# EAGLE design network_tester (EAGLE 9.0.1)

## Sheet 1 of 2
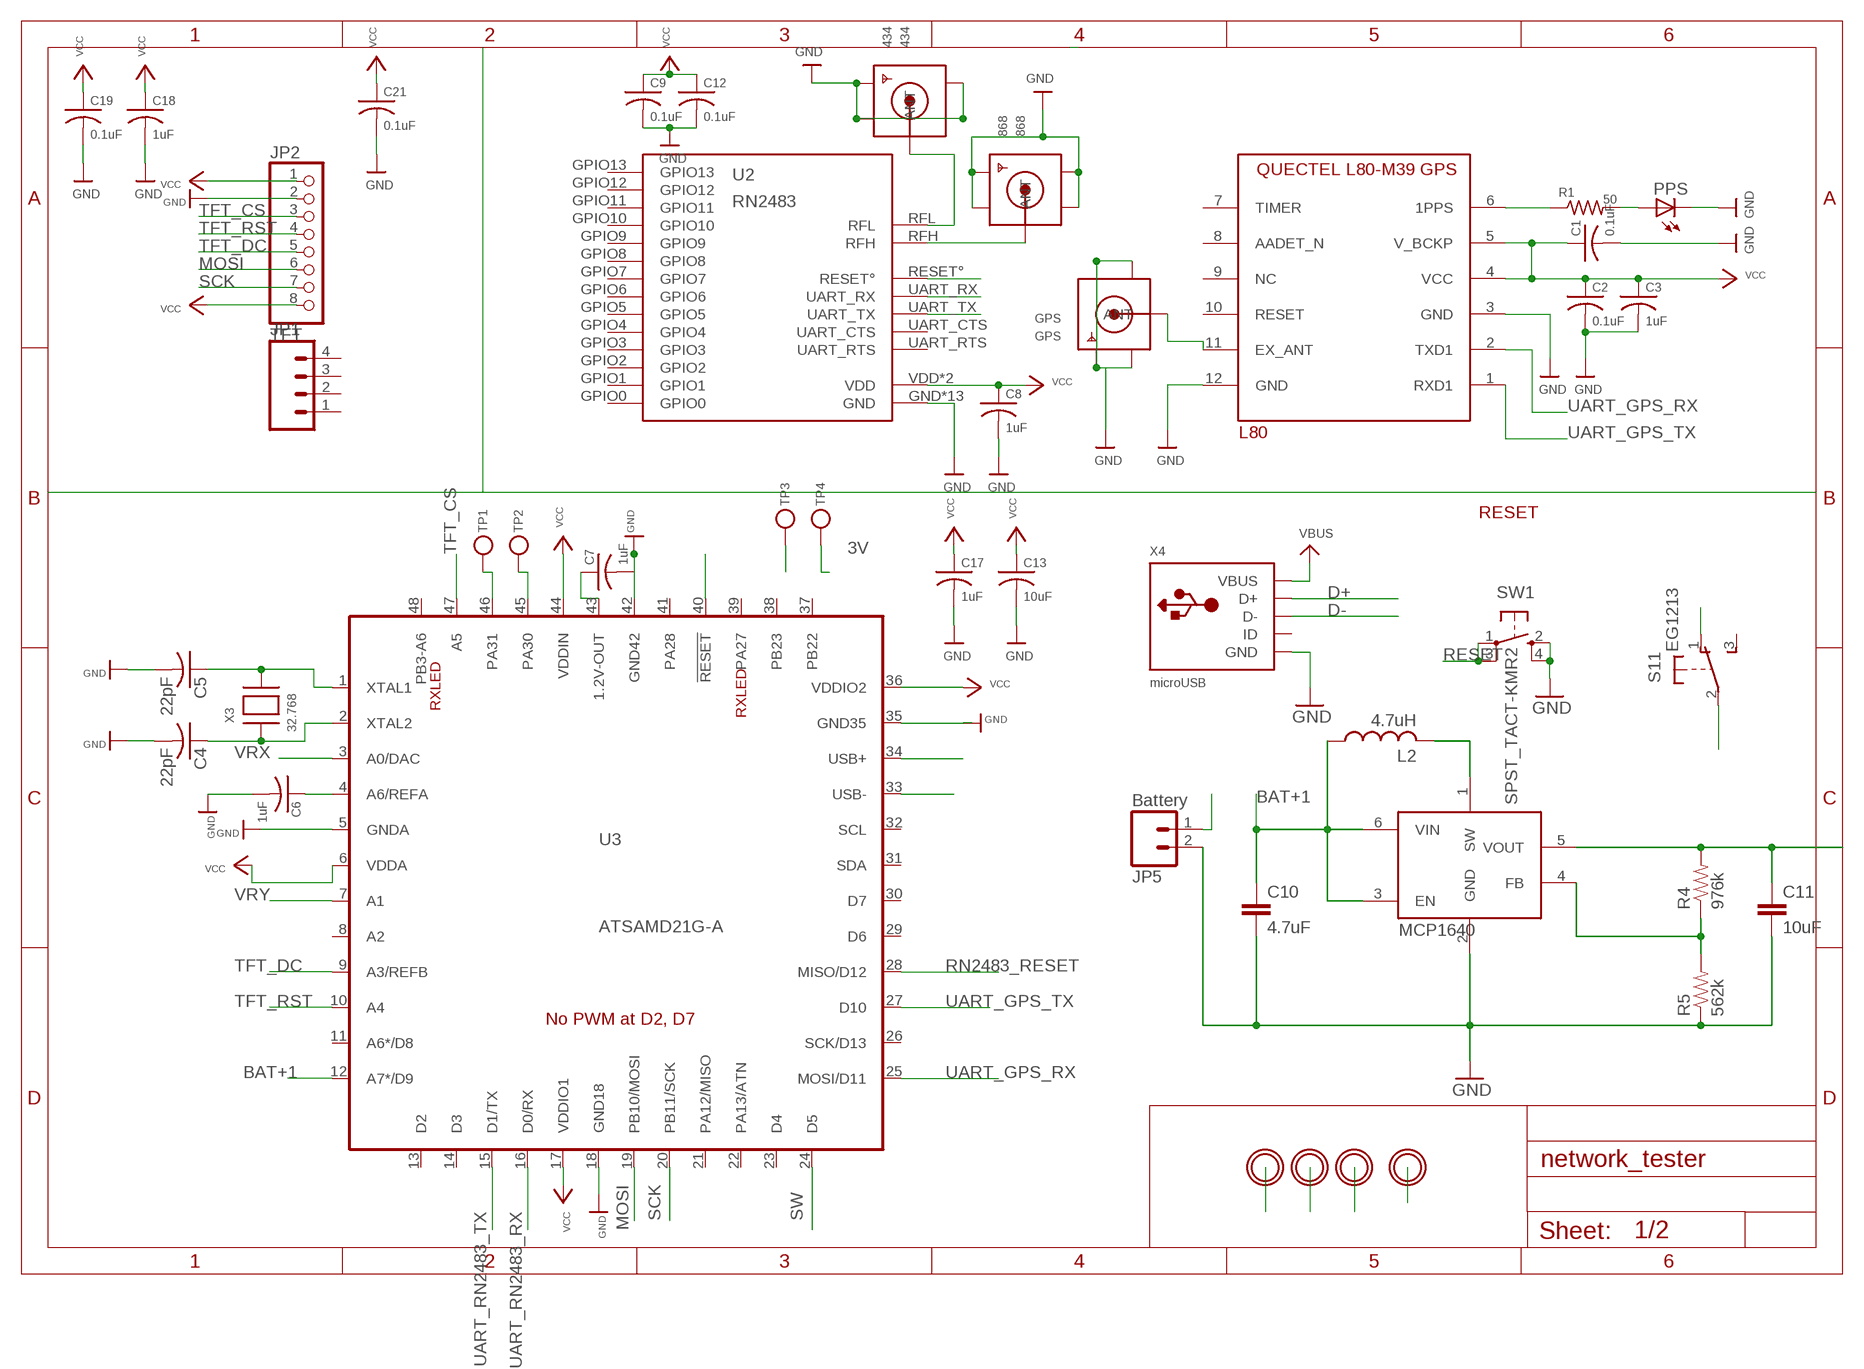
[diagram p0: schematic, sheet 1]

### Parts
434  434  SMACONNECTOR_EDGE_UFL  [SMA_EDGELAUNCH_UFL]
868  868  SMACONNECTOR_EDGE_UFL  [SMA_EDGELAUNCH_UFL]
C1  0.1uF  C-USC0603  [C0603]
C2  0.1uF  C-USC0603  [C0603]
C3  1uF  C-USC0805  [C0805]
C4  22pF  C-USC0603  [C0603]
C5  22pF  C-USC0603  [C0603]
C6  1uF  C-USC0603  [C0603]
C7  1uF  C-USC0603  [C0603]
C8  1uF  C-USC0805  [C0805]
C9  0.1uF  C-USC0603  [C0603]
C10  4.7uF  CAP0805  [0805]
C11  10uF  CAP0805  [0805]
C12  0.1uF  C-USC0603  [C0603]
C13  10uF  C-USC0805  [C0805]
C17  1uF  C-USC0603  [C0603]
C18  1uF  C-USC0805  [C0805]
C19  0.1uF  C-USC0603  [C0603]
C21  0.1uF  C-USC0603  [C0603]
GPS  GPS  SMACONNECTOR_EDGE_UFL  [SMA_EDGELAUNCH_UFL]
H1  MOUNTINGHOLE2.5  [MOUNTINGHOLE_2.5_PLATED]
H2  MOUNTINGHOLE2.5  [MOUNTINGHOLE_2.5_PLATED]
H3  MOUNTINGHOLE2.5  [MOUNTINGHOLE_2.5_PLATED]
H4  MOUNTINGHOLE2.5  [MOUNTINGHOLE_2.5_PLATED]
JP1  M04PTH  [1X04]
JP2  TFT  PINHD-1X8BIG  [1X08-BIG]
JP5  Battery  M02PTH  [1X02]
L2  4.7uH  LLQH44P_P0  [LQH44]
L80  L80  L80_GNSS_MODULE  [L80_PACKAGE]
PPS  LEDCHIPLED_0805  [CHIPLED_0805]
R1  50  R-US_R0805  [R0805]
R4  976k  RESISTOR0805-RES  [0805]
R5  562k  RESISTOR0805-RES  [0805]
S1  EG1213  [EG1213]
SW1  SPST_TACT-KMR2  [KMR2]
TP1  TESTPOINTROUND1.5MM  [TESTPOINT_ROUND_1.5MM]
TP2  TESTPOINTROUND1.5MM  [TESTPOINT_ROUND_1.5MM]
TP3  TESTPOINTROUND1.5MM  [TESTPOINT_ROUND_1.5MM]
TP4  TESTPOINTROUND1.5MM  [TESTPOINT_ROUND_1.5MM]
U2  RN2483  [RN2483]
U3  ATSAMD21G-A  [TQFP-48]
U5  MCP1640  [SOT23-6]
X3  32.768  XTAL-3.2X1.5  [XTAL3215]
X4  microUSB  USB_MICRO_20329_V2  [4UCONN_20329_V2]

### Nets
3V: C1.1 C2.1 C3.1 C8.1 C9.1 C11.1 C12.1 C13.1 C17.1 C18.1 C19.1 C21.1 JP2.1 JP2.8 L80.4(VCC) L80.5(V_BCKP) R4.2 TP4.P$1 U2.VDD U2.VDD2(VDD) U3.6(VDDA) U3.17(VDDIO1) U3.36(VDDIO2) U3.44(VDDIN) U5.5(VOUT) ; supply symbol labelled VCC ; also sheet 2
BAT+1: C10.1 L2.P$1 S1.2(1:P) U3.12(A7*/D9) U5.3(EN) U5.6(VIN)
D+: U3.34(USB+) X4.D+
D-: U3.33(USB-) X4.D-
GND: 434.GND@1(GND1) 434.GND@2(GND2) 434.GND@3(GND3) 434.GND@4(GND4) 868.GND@1(GND1) 868.GND@2(GND2) 868.GND@3(GND3) 868.GND@4(GND4) C1.2 C2.2 C3.2 C4.2 C5.2 C6.2 C8.2 C9.2 C10.2 C11.2 C12.2 C13.2 C17.2 C18.2 C19.2 C21.2 GPS.GND@1(GND1) GPS.GND@2(GND2) GPS.GND@3(GND3) GPS.GND@4(GND4) JP2.2 JP5.2 L80.3(GND) L80.12(GND) PPS.C R5.1 SW1.2(S) SW1.4(S1) TP3.P$1 U2.GND U2.GND1(GND) U2.GND2(GND) U2.GND3(GND) U2.GND4(GND) U2.GND5(GND) U2.GND6(GND) U2.GND7(GND) U2.GND8(GND) U2.GND9(GND) U2.GND10(GND) U2.GND11(GND) U2.GND12(GND) U3.5(GNDA) U3.18(GND18) U3.35(GND35) U3.42(GND42) U5.2(GND) X4.BASE@1(GND) X4.BASE@2(GND) X4.GND X4.SPRT@1(GND) X4.SPRT@2(GND) X4.SPRT@3(GND) X4.SPRT@4(GND) ; also sheet 2
MOSI: JP2.6 U3.19(PB10/MOSI)
N$1: L80.6(1PPS) R1.1
N$2: PPS.A R1.2
N$3: C4.1 U3.2(XTAL2) X3.P$1
N$5: 868.P(ANT) U2.RFH
N$7: C5.1 U3.1(XTAL1) X3.P$2
N$8: C6.1 U3.4(A6/REFA)
N$9: C7.1 U3.43(1.2V-OUT)
N$10: TP1.P$1 U3.46(PA31)
N$11: TP2.P$1 U3.45(PA30)
N$12: 434.P(ANT) U2.RFL
N$15: L2.P$2 U5.1(SW)
N$16: R4.1 R5.2 U5.4(FB)
N$18: GPS.P(ANT) L80.11(EX_ANT)
PWRIN: JP5.1 S1.1(1:O)
RESET: SW1.1(P) SW1.3(P1) U3.40(!RESET!)
RN2483_RESET: U2.RESET° U3.28(MISO/D12)
SCK: JP2.7 U3.20(PB11/SCK)
SW: U3.24(D5) ; also sheet 2
TFT_CS: JP2.3 U3.47(A5)
TFT_DC: JP2.5 U3.9(A3/REFB)
TFT_RST: JP2.4 U3.10(A4)
UART_GPS_RX: L80.2(TXD1) U3.25(MOSI/D11)
UART_GPS_TX: L80.1(RXD1) U3.27(D10)
UART_RN2483_RX: U2.UART_TX U3.16(D0/RX)
UART_RN2483_TX: U2.UART_RX U3.15(D1/TX)
VBUS: X4.VBUS
VRX: U3.3(A0/DAC) ; also sheet 2
VRY: U3.7(A1) ; also sheet 2
Unconnected: C7.2 JP1.1 JP1.2 JP1.3 JP1.4 L80.7(TIMER) L80.8(AADET_N) L80.9(NC) L80.10(RESET) S1.3(1:S) S1.MT1(MT) S1.MT2(MT) U2.GPIO0 U2.GPIO1 U2.GPIO2 U2.GPIO3 U2.GPIO4 U2.GPIO5 U2.GPIO6 U2.GPIO7 U2.GPIO8 U2.GPIO9 U2.GPIO10 U2.GPIO11 U2.GPIO12 U2.GPIO13 U2.UART_CTS U2.UART_RTS U3.8(A2) U3.11(A6*/D8) U3.13(D2) U3.14(D3) U3.21(PA12/MISO) U3.22(PA13/ATN) U3.23(D4) U3.26(SCK/D13) U3.29(D6) U3.30(D7) U3.31(SDA) U3.32(SCL) U3.37(PB22) U3.38(PB23) U3.39(PA27) U3.41(PA28) U3.48(PB3-A6) X4.ID

### Notes on the sheet
- RESET

## Sheet 2 of 2
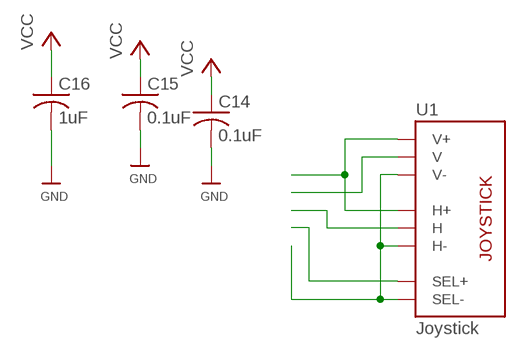
[diagram p1: schematic, sheet 2]

### Parts
C14  0.1uF  C-USC0603  [C0603]
C15  0.1uF  C-USC0603  [C0603]
C16  1uF  C-USC0805  [C0805]
U1  Joystick  JOYSTICKPTH  [JOYSTICK]

### Nets
3V: C14.1 C15.1 C16.1 U1.H1(H+) U1.V1(V+) ; supply symbol labelled VCC ; also sheet 1
GND: C14.2 C15.2 C16.2 U1.B2A(SEL-) U1.H3(H-) U1.V3(V-) ; also sheet 1
SW: U1.B1A(SEL+) ; also sheet 1
VRX: U1.H2(H) ; also sheet 1
VRY: U1.V2(V) ; also sheet 1

## Library data of the parts
434 868 GPS = adafruit:SMACONNECTOR: SMA Connector 90° DIP SMA Connector, 50 Ohm (4UConnector: 07259)
C1-C9 C12-C19 C21 = adafruit:C-US: CAPACITOR, American symbol
C10 C11 = SparkFun:CAP: Capacitor Standard 0603 ceramic capacitor, and 0.1" leaded capacitor.
H1-H4 = Adafruit Feather M0 Basic rev C:MOUNTINGHOLE: Mounting Hole For #2 screws (0.086"/2.18mm width, 0.094"/2.4mm hole) use 2.5mm; BOM: EXCLUDE
JP1 = SparkFun-Connectors:M04: Header 4 Standard 4-pin 0.1" header. Use with straight break away headers (SKU : PRT-00116), right angle break away headers (PRT-00553), swiss pins (PRT-00743), machine pins (PRT-00117), and female headers (PRT-00115). Molex polarized connector foot print use with SKU : PRT-08231 with associated crimp pins and housings. 1MM SMD Version SKU: PRT-10208
JP2 = adafruit:PINHD-1X8: PIN HEADER
JP5 = SparkFun:M02: Header 2 Standard 2-pin 0.1" header. Use with straight break away headers (SKU : PRT-00116), right angle break away headers (PRT-00553), swiss pins (PRT-00743), machine pins (PRT-00117), and female headers (PRT-00115). Molex polarized connector foot print use with SKU : PRT-08233 with associated crimp pins and housings.
L2 = karlnet-parts:L
L80 = Quectel:L80_GNSS_MODULE: GPS module with an embedded patch antenna (15mmx15mmx4mm)
PPS = adafruit:LED: LED OSRAM: - CHIPLED LG R971, LG N971, LY N971, LG Q971, LY Q971, LO R971, LY R971 LH N974, LH R974 LS Q976, LO Q976, LY Q976 LO Q996 - Hyper CHIPLED LW Q18S LB Q993, LB Q99A, LB R99A - SideLED LS A670, LO A670, LY A670, LG A670, LP A670 LB A673, LV A673, LT A673, LW A673 LH A674 LY A675 LS A676, LA A676, LO A676, LY A676, LW A676 LS A679, LY A679, LG A679 - Hyper Micro SIDELED® LS Y876, LA Y876, LO Y876, LY Y876 LT Y87S - SmartLED LW L88C, LW L88S LB L89C, LB L89S, LG L890 LS L89K, LO L89K, LY L89K LS L896, LA L896, LO L896, LY L896 - TOPLED LS T670, LO T670, LY T670, LG T670, LP T670 LSG T670, LSP T670, LSY T670, LOP T670, LYG T670 LG T671, LOG T671, LSG T671 LB T673, LV T673, LT T673, LW T673 LH T674 LS T676, LA T676, LO T676, LY T676, LB T676, LH T676, LSB T676, LW T676 LB T67C, LV T67C, LT T67C, LS T67K, LO T67K, LY T67K, LW E67C LS E67B, LA E67B, LO E67B, LY E67B, LB E67C, LV E67C, LT E67C LW T67C LS T679, LY T679, LG T679 LS T770, LO T770, LY T770, LG T770, LP T770 LB T773, LV T773, LT T773, LW T773 LH T774 LS E675, LA E675, LY E675, LS T675 LS T776, LA T776, LO T776, LY T776, LB T776 LHGB T686 LT T68C, LB T68C - Hyper Mini TOPLED® LB M676 - Mini TOPLED Santana® LG M470 LS M47K, LO M47K, LY M47K Source: http://www.osram.convergy.de/
R1 = adafruit:R-US_: RESISTOR, American symbol
R4 R5 = SparkFun:RESISTOR: Resistor Basic schematic elements and footprints for 0603, 1206, and PTH resistors.
S1 = adafruit:EG1213: E-Switch right-angle slide SPDT Part #EG1213 http://www.ladyada.net/library/eagle
SW1 = adafruit:SPST_TACT: SMT 6mm switch, EVQQ2 series http://www.ladyada.net/library/eagle
TP1-TP4 = Adafruit Feather M0 Basic rev C:TESTPOINT: Test Point Various test points for characterisation and PCB testing TESTPOINT_SMT - Compact Surface Mount Test Point [Digikey: 5016KTR-ND]
U1 = adafruit:JOYSTICK: Thumb Joystick Joystick commonly found in PS2 controllers. Two pots and a select switch. Adapted from Sparkfun Library (but for more common 6mm switch sticks)
U2 = tobias:RN2483: RN2483 Microchip Low-Power Lora Transceiver Module NOT TESTED There are testpads on the bottom of the device. The mask is supposed to cover that, but I have not tested it in practice yet. Info: http://www.microchip.com/wwwproducts/Devices.aspx?product=RN2483 Datasheet: http://ww1.microchip.com/downloads/en/DeviceDoc/50002346B.pdf Adapted from: https://github.com/Octanis1/Octanis1-Electronics/blob/ae493cac28c100e20856abe563dfe8824e9cc4bd/lib/Octanis1.lbr
U3 = Albert-Arduino:ATSAMD21G: Atmel SAMD21G SMART ARM-Based Microcontroller The Atmel ® | SMART  SAM D21 is a series of low-power microcontrollers using the 32-bit ARM ® Cortex ® -M0+ processor, and ranging from 32- to 64-pins with up to 256KB Flash and 32KB of SRAM. The SAM D21 devices operate at a maximum frequency of 48MHz and reach 2.46 CoreMark/MHz. They are designed for simple and intuitive migration with identical peripheral modules, hex compatible code, identical linear address map and pin compatible migration paths between all devices in the product series. All devices include intelligent and flexible peripherals, Atmel Event System for inter-peripheral signaling, and support for capacitive touch button, slider and wheel user interfaces.; PROD_ID: IC-13064
U5 = karlnet-parts:MCP1640: MCP1623, 1624, 1640/B/C/D pwm/pfm or pwm only DC/DC converters, in SOT-23
X3 = Adafruit Feather M0 Basic rev C:XTAL: Low cost SMT crystals, no capacitors included http://www.ladyada.net/library/eagle
X4 = microbuilder:USB: USB Connectors USBMINIB - Surface Mount Female Mini-B USB Connector 4UConnector: 06564

## Board
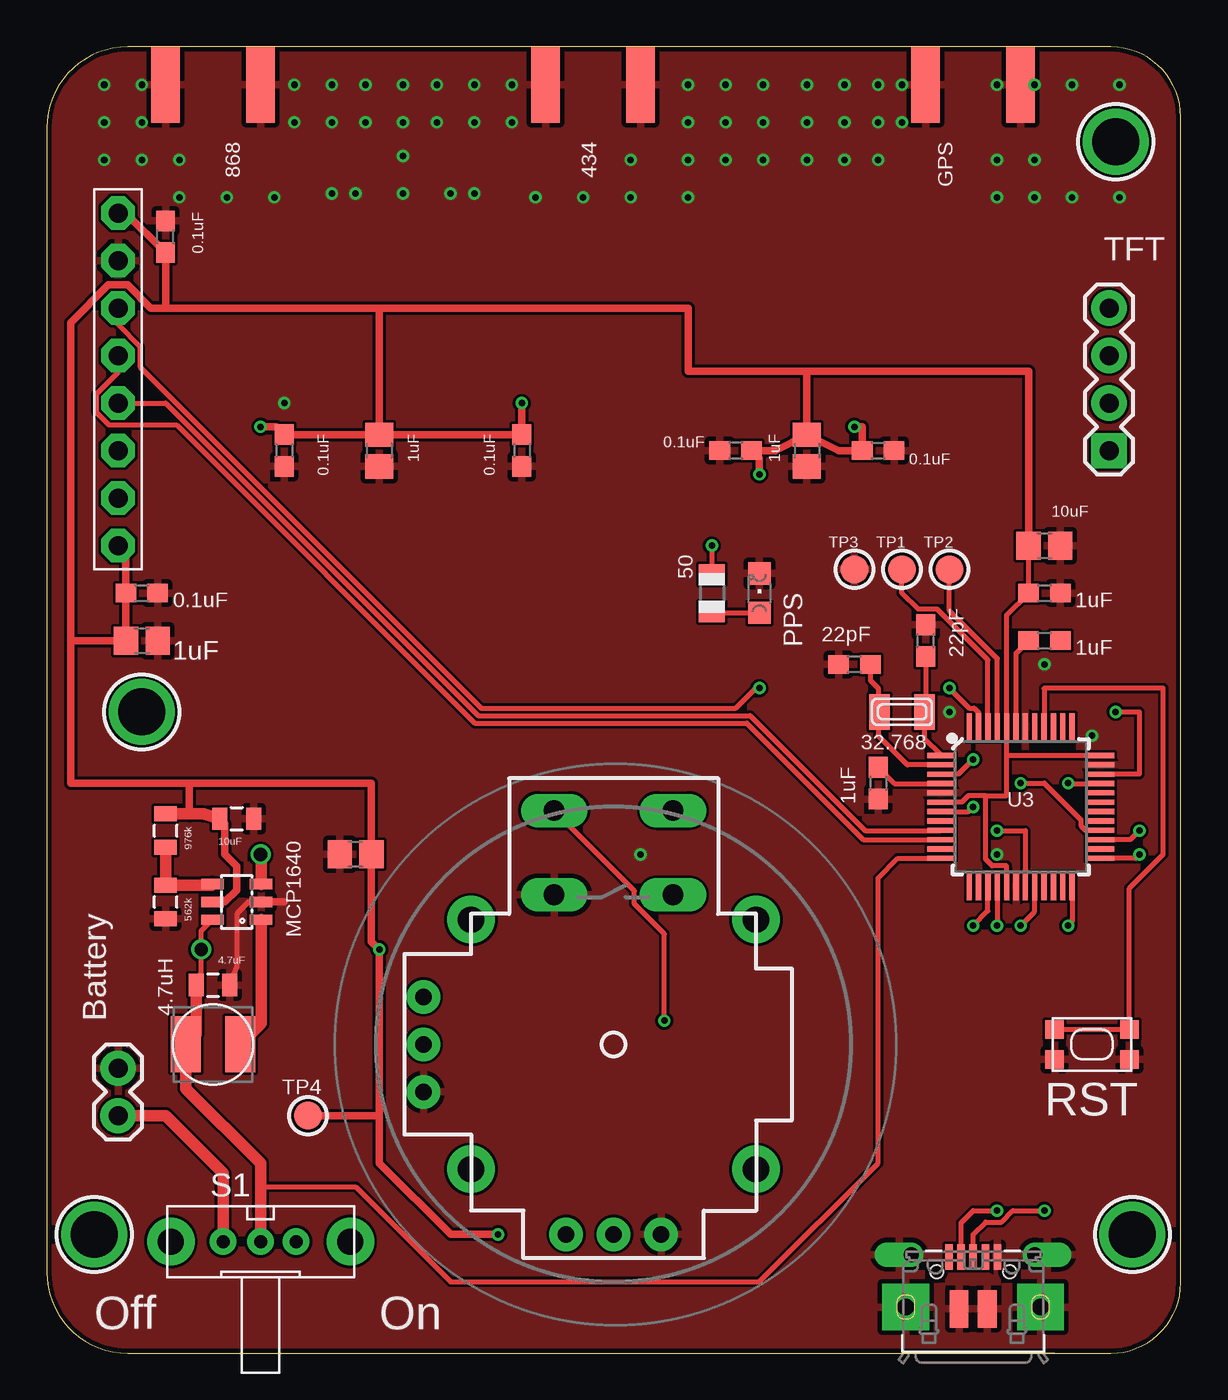
[diagram p2: board, top side]
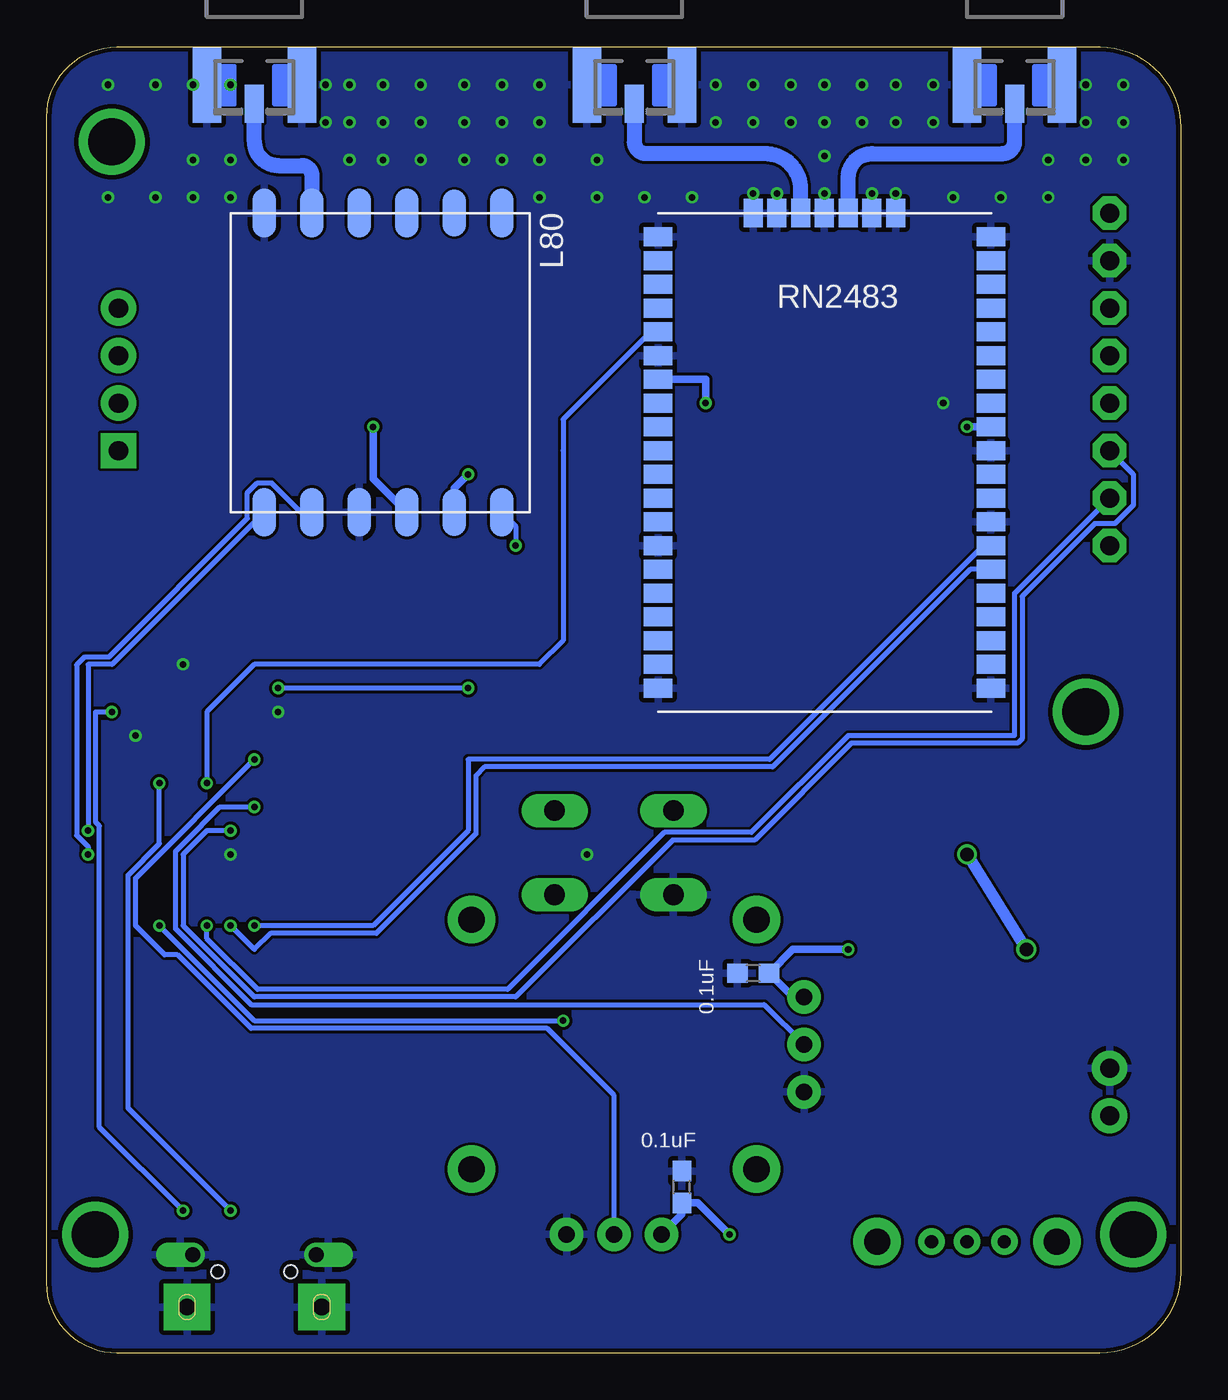
[diagram p3: board, bottom side, seen from below]

Size 60.63 x 69.84 mm. Coordinates in mm from the lower left corner, seen from the top.
Outline: 60.63,3.75 60.63,66.1 arc90 56.89,69.84 4.32,69.84 arc90 0,65.52 0,4.34 arc90 4.34,0 56.88,0 arc90 60.63,3.75
Copper layers (1*16): Top 0.035mm / dielectric 1.5mm / Bottom 0.035mm
Design rules "SeeedStudio_2layer_DRU_no_angle_20140221": minimum track width 6mil, minimum drill 12mil, track to track 6mil, track to pad 6mil, pad to pad 6mil, via to via 6mil, smd to smd 0mil, copper to edge 10mil, drill to drill 10mil, minimum pad ring 10mil, minimum via ring 6mil, stop-mask expansion 2mil, vias tented up to drill 100mil, thermal gap 10mil

### Footprints (pad centres in the part's own frame; a part is rotated, then mirrored left to right if it is on the bottom)
SMA_EDGELAUNCH_UFL = smd 4.064 x 1.524: GND@1 2.032,-2.54; GND@2 2.032,2.54 | smd 4.064 x 1.524 bottom: GND@3 2.032,2.54; GND@4 2.032,-2.54 | smd 2.032 x 1.016: P 3.048,0
C0603 = smd 1.1 x 1: 1 -0.85,0; 2 0.85,0
C0805 = smd 1.3 x 1.5: 1 -0.85,0; 2 0.85,0
0805 = smd 0.8 x 1.2: 1 -0.9,0; 2 0.9,0
MOUNTINGHOLE_2.5_PLATED = drill 2.5 pad 3.2: P$1 0,0
1X04 = drill 1.016 pad 1.88 square: 1 0,0 | drill 1.016 pad 1.88: 2 2.54,0; 3 5.08,0; 4 7.62,0
1X08-BIG = drill 1.016 pad 1.778 octagon: 1 -8.89,0; 2 -6.35,0; 3 -3.81,0; 4 -1.27,0; 5 1.27,0; 6 3.81,0; 7 6.35,0; 8 8.89,0
1X02 = drill 1.016 pad 1.88: 1 0,0; 2 2.54,0
LQH44 = smd 1.6 x 3: P$1 -1.45,0; P$2 1.45,0
L80_PACKAGE = smd 2.6 x 1.25: 1 16,1.8; 2 16,4.34; 3 16,6.88; 4 16,9.42; 6 16,14.5; 7 0,14.5; 9 0,9.42; 10 0,6.88; 11 0,4.34; 12 0,1.8 | smd 2.5 x 1.25: 5 16,11.96; 8 0,11.96
CHIPLED_0805 = smd 1.2 x 1.2: A 0,-1.05; C 0,1.05
R0805 = smd 1.1 x 1.4: 1 -1,0; 2 1,0
EG1213 = drill 0.7 pad 1.422: 1 -2,0; 2 0,0; 3 1.9,0 | drill 1.4 pad 2.54: MT1 -4.8,0; MT2 4.8,0
KMR2 = smd 1 x 1: 1 2,0.8; 2 2,-0.8; 3 -2,0.8; 4 -2,-0.8
TESTPOINT_ROUND_1.5MM = smd 1.5 x 1.5: P$1 0,0
JOYSTICK = drill 1.1 pad 1.778 long: B1A -3.175,12.501; B1B 3.175,12.501; B2A -3.175,8.001; B2B 3.175,8.001 | drill 0.889 pad 1.778: H1 -2.54,-10.16; H2 0,-10.16; H3 2.54,-10.16; V1 -10.16,2.54; V2 -10.16,0; V3 -10.16,-2.54 | drill 1.397 pad 2.54: MOUNT1 -7.62,6.668; MOUNT2 -7.62,-6.668; MOUNT3 7.62,-6.668; MOUNT4 7.62,6.668
RN2483 = smd 1.524 x 1.016: GND 17.78,1.27; GND1 17.78,10.16; GND2 17.78,13.97; GND3 17.78,25.4; GND9 0,25.4; GND10 0,19.05; GND11 0,8.89; GND12 0,1.27; GPIO0 0,16.51; GPIO1 0,15.24; GPIO2 0,13.97; GPIO3 0,12.7; GPIO4 0,11.43; GPIO5 0,10.16; GPIO6 0,6.35; GPIO7 0,5.08; GPIO8 0,3.81; GPIO9 0,2.54; GPIO10 17.78,17.78; GPIO11 17.78,16.51; GPIO12 17.78,12.7; GPIO13 17.78,11.43; P$1 0,21.59; P$2 0,22.86; P$3 0,24.13; P$4 17.78,24.13; P$5 17.78,22.86; P$6 17.78,21.59; P$7 17.78,20.32; P$8 17.78,19.05; P$9 17.78,6.35; P$10 17.78,5.08; P$11 0,7.62; RESET° 0,20.32; UART_CTS 17.78,3.81; UART_RTS 17.78,2.54; UART_RX 17.78,8.89; UART_TX 17.78,7.62; VDD 17.78,15.24; VDD2 0,17.78 | smd 1.016 x 1.524: GND4 12.7,26.67; GND5 11.43,26.67; GND6 8.89,26.67; GND7 6.35,26.67; GND8 5.08,26.67; RFH 10.16,26.67; RFL 7.62,26.67
TQFP-48 = smd 1.5 x 0.28: 1 -4.25,2.75; 2 -4.25,2.25; 3 -4.25,1.75; 4 -4.25,1.25; 5 -4.25,0.75; 6 -4.25,0.25; 7 -4.25,-0.25; 8 -4.25,-0.75; 9 -4.25,-1.25; 10 -4.25,-1.75; 11 -4.25,-2.25; 12 -4.25,-2.75; 25 4.25,-2.75; 26 4.25,-2.25; 27 4.25,-1.75; 28 4.25,-1.25; 29 4.25,-0.75; 30 4.25,-0.25; 31 4.25,0.25; 32 4.25,0.75; 33 4.25,1.25; 34 4.25,1.75; 35 4.25,2.25; 36 4.25,2.75 | smd 0.28 x 1.5: 13 -2.75,-4.25; 14 -2.25,-4.25; 15 -1.75,-4.25; 16 -1.25,-4.25; 17 -0.75,-4.25; 18 -0.25,-4.25; 19 0.25,-4.25; 20 0.75,-4.25; 21 1.25,-4.25; 22 1.75,-4.25; 23 2.25,-4.25; 24 2.75,-4.25; 37 2.75,4.25; 38 2.25,4.25; 39 1.75,4.25; 40 1.25,4.25; 41 0.75,4.25; 42 0.25,4.25; 43 -0.25,4.25; 44 -0.75,4.25; 45 -1.25,4.25; 46 -1.75,4.25; 47 -2.25,4.25; 48 -2.75,4.25
SOT23-6 = smd 0.55 x 1.2: 1 -0.95,-1.3; 2 0,-1.3; 3 0.95,-1.3; 4 0.95,1.3; 5 0,1.3; 6 -0.95,1.3
XTAL3215 = smd 1.1 x 1.9: P$1 1.2,0; P$2 -1.2,0
4UCONN_20329_V2 = smd 1 x 2: BASE@1 -0.75,-2; BASE@2 0.75,-2 | smd 0.4 x 1.35: D+ 0,0.775; D- -0.65,0.775; GND 1.3,0.775; ID 0.65,0.775; VBUS -1.3,0.775 | drill 0.8 pad 1.2 offset: SPRT@1 -3.3,0.9; SPRT@2 3.3,0.9 | drill 0.9 pad 2.5 square: SPRT@3 -3.6,-1.9; SPRT@4 3.6,-1.9 | hole 0.7: -1.95,0; 1.95,0

### Placement (x,y rotation side)
434  29.21,69.85 270 bottom
868  8.89,69.85 270 bottom
C1  36.83,48.26 180 top
C2  44.45,48.26 0 top
C3  40.64,48.26 270 top
C4  43.18,36.83 180 top
C5  46.99,38.1 90 top
C6  44.45,30.48 270 top
C7  53.34,38.1 0 top
C8  17.78,48.26 270 top
C9  12.7,48.26 270 top
C10  8.89,19.68 0 top
C11  10.16,28.57 0 top
C12  25.4,48.26 270 top
C13  53.34,43.18 0 top
C14  22.86,20.32 180 bottom
C15  26.67,8.89 90 bottom
C16  16.51,26.67 180 top
C17  53.34,40.64 0 top
C18  5.08,38.1 0 top
C19  5.08,40.64 0 top
C21  6.35,59.69 90 top
GPS  49.53,69.85 270 bottom
H1  2.54,6.35 0 top
H2  5.08,34.29 0 top
H3  57.15,64.77 0 top
H4  58.04,6.35 0 top
JP1  56.79,48.26 90 top
JP2  3.81,52.07 270 top
JP5  3.81,12.7 90 top
L2  8.89,16.51 0 top
L80  50.8,60.96 270 bottom
PPS  38.1,40.64 0 top
R1  35.56,40.64 270 top
R4  6.35,27.94 90 top
R5  6.35,24.13 90 top
S1  11.43,5.97 0 top
SW1  55.88,16.51 0 top
TP1  45.72,41.91 0 top
TP2  48.26,41.91 0 top
TP3  43.18,41.91 0 top
TP4  13.97,12.7 0 top
U1  30.3,16.51 0 top
U2  27.94,34.29 0 bottom
U3  52.07,29.21 0 top
U5  10.16,24.13 90 top
X3  45.72,34.29 180 top
X4  49.53,4.37 0 top

### Tracks (layer width: path | path; a pad name or v marks a point on that pad's centre or on a via)
3V  (via drill 0.35)
  Top 0.254: U3.6 48.92,29.46 49.28,29.82 50.19,29.82 | 51.32,31.96 51.32,29.82 50.19,29.82 | 51.32,31.96 U3.44 51.32,39.47 C17.1 C13.1 | U3.17 51.32,26.06 50.55,26.06 50.19,26.42 50.19,29.82 | 51.32,31.96 U3.36
  Top 0.406: 1.27,38.1 1.27,30.48 7.62,30.48 | 7.62,30.48 17.36,30.48 C16.1 17.36,22.01 v17.78,21.59 17.78,12.7 | U5.5 9.53,24.13 10.16,24.77 10.16,26.04 9.53,26.67 9.53,28.31 C11.1 | v25.4,50.8 C12.1 C8.1 | C8.1 C9.1 12.28,49.53 v11.43,49.53 | C8.1 17.78,55.88 | 17.78,55.88 34.29,55.88 34.29,52.49 40.64,52.49 | C3.1 38.95,48.26 C1.1 38.1,47.84 v38.1,46.99 | C3.1 42.33,48.26 C2.1 43.6,49.53 v43.18,49.53 | C3.1 40.64,52.49 | C13.1 52.49,52.49 40.64,52.49 | 1.27,38.1 C18.1 C19.1 4.23,42.76 JP2.8 | 6.35,55.88 17.78,55.88 | 6.35,55.88 5.57,55.88 4.33,57.12 3.29,57.12 1.27,55.1 1.27,38.1 | JP2.1 4.23,60.96 C21.1 6.35,55.88 | 7.62,28.84 7.62,30.48 | 17.78,12.7 17.78,10.16 21.59,6.35 v24.13,6.35 | 17.78,12.7 TP4.P$1
  Top 0.61: R4.2 7.62,28.84 8.36,28.84 C11.1
  Bottom 0.406: L80.5 38.84,46.25 v38.1,46.99 | U2.VDD2 25.4,52.07 v25.4,50.8 | v11.43,49.53 U2.VDD | L80.4 43.18,46.76 v43.18,49.53 | U1.V1 20.74,19.05 C14.1 20.74,21.59 v17.78,21.59 | v24.13,6.35 25.82,8.04 C15.1 26.67,7.44 U1.H1
BAT+1  (via drill 0.71)
  Top 0.254: C10.1 7.99,20.05 8.26,20.32 v8.26,21.59 8.26,22.57 U5.6 | U3.12 45.51,26.46 44.45,25.4 44.45,10.16 38.1,3.81 21.59,3.81 16.51,8.89 11.43,8.89 | 11.59,7.46 11.43,7.62
  Top 0.61: C10.1 7.99,17.06 L2.P$1 7.44,14.15 11.43,10.16 11.43,8.89 11.43,7.62 S1.2 | U5.3 11.46,26.64 v11.43,26.67
  Bottom 0.61: v8.26,21.59 v11.43,26.67
D+  (via drill 0.35)
  Top 0.254: v57.15,34.29 58.42,34.29 58.42,30.96 U3.34 | X4.D+ 49.53,6.35 50.19,7.01 51.05,7.01 51.66,7.62 v53.34,7.62
  Bottom 0.254: v53.34,7.62 57.81,12.09 57.81,28.19 58.01,28.39 58.01,34.29 v57.15,34.29
D-  (via drill 0.35)
  Top 0.254: v54.61,30.48 54.63,30.46 U3.33 | X4.D- 48.88,6.97 49.53,7.62 v50.8,7.62
  Bottom 0.254: v54.61,30.48 54.61,27.25 56.29,25.57 56.29,13.11 v50.8,7.62
GND  (via drill 0.35)
  Top 0.254: U5.2 10.79,24.13 10.16,23.5 10.16,20.69 C10.2
  Top 0.406: 12.7,24.13 U5.2
  other vias: 31.75,26.67 50.8,26.67 48.26,34.29 55.88,33.02 53.34,36.83 5.08,67.82 5.08,65.81 12.7,50.8 3.07,65.81 3.07,67.82 19.05,67.82 19.05,65.81 17.04,65.81 17.04,67.82 15.24,67.82 15.24,65.81 13.23,65.81 13.23,67.82 24.87,67.82 24.87,65.81 22.86,67.82 22.86,65.81 20.85,65.81 20.85,67.82 36.3,67.82 36.3,65.81 34.29,67.82 34.29,65.81 19.05,64.01 19.05,62 16.51,62 15.24,62 21.59,62 22.86,62 5.08,63.8 3.07,63.8 7.09,63.8 7.09,61.8 9.63,61.8 12.17,61.8 26.14,61.8 28.68,61.8 31.22,61.8 31.22,63.8 34.29,63.8 36.3,63.8 44.45,63.8 38.3,65.81 38.3,67.82 38.3,63.8 42.65,67.82 42.65,65.81 40.64,67.82 40.64,65.81 40.64,63.8 42.65,63.8 44.45,67.82 52.81,67.82 50.8,67.82 44.45,65.81 50.8,63.8 52.81,63.8 54.81,67.82 57.35,67.82 34.29,61.8 50.8,61.8 52.81,61.8 54.81,61.8 57.35,61.8 45.72,67.82 45.72,65.81
  pour Top: -1.27,71.12 62.23,71.12 62.23,-3.81 -1.27,-3.81
  pour Bottom: -1.27,71.12 62.23,71.12 62.23,-3.81 -1.27,-3.81
MOSI  (via drill 0.35)
  Top 0.254: v50.8,27.94 52.32,27.94 U3.19
  Bottom 0.254: JP2.6 2.54,46.99 2.54,45.34 3.53,44.35 4.61,44.35 8.48,40.47 8.48,32.85 8.72,32.61 17.61,32.61 22.79,27.44 27.17,27.44 35.56,19.05 49.53,19.05 53.34,22.86 53.34,26.67 52.07,27.94 v50.8,27.94
N$1  (via drill 0.35)
  Top 0.254: v35.56,43.18 R1.1
  Bottom 0.254: L80.6 35.56,44.22 v35.56,43.18
N$2
  Top 0.254: R1.2 35.61,39.59 PPS.A
N$3
  Top 0.254: U3.2 46.01,31.46 44.45,33.02 44.45,34.22 | 44.45,34.22 X3.P$1 | C4.1 44.03,35.98 44.45,35.56 44.45,34.22
N$5
  Bottom 0.813: U2.RFH 17.78,62.87 arc90 16.51,64.14 9.53,64.14 arc-90 8.89,64.77 868.P
N$7
  Top 0.254: U3.1 46.92,32.86 X3.P$2 46.99,34.36 C5.1
N$8
  Top 0.254: C6.1 45.32,30.46 U3.4
N$9
  Top 0.254: U3.43 51.82,37.43 C7.1
N$10
  Top 0.254: U3.46 50.32,37.06 47.61,39.78 46.58,39.78 45.72,40.64 TP1.P$1
N$11
  Top 0.254: U3.45 50.82,37.14 48.26,39.7 TP2.P$1
N$12
  Bottom 0.813: U2.RFL 20.32,62.23 arc-90 22.23,64.14 28.57,64.14 arc90 29.21,64.77 434.P
N$15
  Top 0.61: L2.P$2 11.46,17.63 U5.1
N$16
  Top 0.61: R4.1 R5.2 8.81,25.03 U5.4
N$18
  Bottom 0.813: GPS.P 49.53,64.77 arc-90 48.26,63.5 46.99,63.5 arc90 46.46,62.97 L80.11
PWRIN
  Top 0.61: S1.1 9.43,9.62 6.35,12.7 JP5.1
RESET
  Top 0.254: U3.40 53.32,35.54 53.34,35.56 59.69,35.56 59.69,26.67 57.88,24.86 SW1.1 SW1.3
RN2483_RESET  (via drill 0.35)
  Top 0.254: U3.28 55.53,27.96 55.29,28.2 55.29,28.53 53.34,30.48 v52.07,30.48
  Bottom 0.254: U2.RESET° 28.34,54.61 33.02,49.92 33.02,48.26 33.02,38.1 34.29,36.83 49.53,36.83 52.07,34.29 v52.07,30.48
SCK  (via drill 0.35)
  Top 0.254: v52.07,22.86 52.82,23.61 U3.20
  Bottom 0.254: JP2.7 8.89,40.64 8.89,33.02 17.78,33.02 22.96,27.84 27.6,27.84 35.99,19.46 49.36,19.46 52.07,22.16 v52.07,22.86
SW  (via drill 0.35)
  Top 0.254: U3.24 54.82,23.07 v54.61,22.86 | U1.B1A 31.42,24.72 31.42,24.03 33.02,22.43 v33.02,17.78
  Bottom 0.254: v33.02,17.78 49.53,17.78 v54.61,22.86
TFT_CS  (via drill 0.35)
  Top 0.254: v48.26,35.56 49.33,34.49 49.58,34.49 49.82,34.24 U3.47 | JP2.3 3.81,54.99 4.98,53.82 4.98,52.75 23.23,34.5 36.83,34.5 37.89,35.56 v38.1,35.56
  Bottom 0.254: v38.1,35.56 v48.26,35.56
TFT_DC
  Top 0.254: JP2.5 6.35,50.8 23.06,34.09 37.6,34.09 43.76,27.94 47.8,27.94 U3.9
TFT_RST
  Top 0.254: JP2.4 3.81,52.45 2.64,51.28 2.64,50.32 3.33,49.63 6.94,49.63 22.89,33.68 37.44,33.68 43.66,27.46 U3.10
UART_GPS_RX  (via drill 0.35)
  Top 0.254: v58.42,26.67 58.21,26.46 U3.25
  Bottom 0.254: L80.2 47.05,44.96 48.62,46.54 49.38,46.54 49.9,46.01 49.9,44.63 57.3,37.24 58.59,37.24 59.03,36.8 59.03,27.69 58.42,27.08 v58.42,26.67
UART_GPS_TX  (via drill 0.35)
  Top 0.254: v58.42,27.94 57.94,27.46 U3.27
  Bottom 0.254: L80.1 57.13,36.83 58.42,36.83 v58.42,27.94
UART_RN2483_RX  (via drill 0.35)
  Top 0.254: U3.16 50.82,22.88 v50.8,22.86
  Bottom 0.254: 10.55,41.91 U2.UART_TX 11.25,41.91 21.82,31.34 37.24,31.34 37.69,30.89 37.69,27.77 43.01,22.45 48.67,22.45 49.53,21.59 v50.8,22.86
UART_RN2483_TX  (via drill 0.35)
  Top 0.254: v49.53,22.86 50.32,23.65 U3.15
  Bottom 0.254: v49.53,22.86 43.18,22.86 38.1,27.94 38.1,31.75 21.98,31.75 10.55,43.18 U2.UART_RX
VRX  (via drill 0.35)
  Top 0.254: v49.53,31.75 48.74,30.96 U3.3
  Bottom 0.254: v49.53,31.75 55.88,25.4 55.88,22.86 54.32,21.3 53.63,21.3 49.7,17.37 33.88,17.37 30.3,13.79 U1.H2
VRY  (via drill 0.35)
  Top 0.254: U3.7 49.28,28.96 v49.53,29.21
  Bottom 0.254: U1.V2 22.28,18.64 49.7,18.64 53.75,22.69 53.75,26.84 53.63,26.96 53.31,27.28 51.38,29.21 v49.53,29.21

### Text on the board
tNames: RST | Off | On